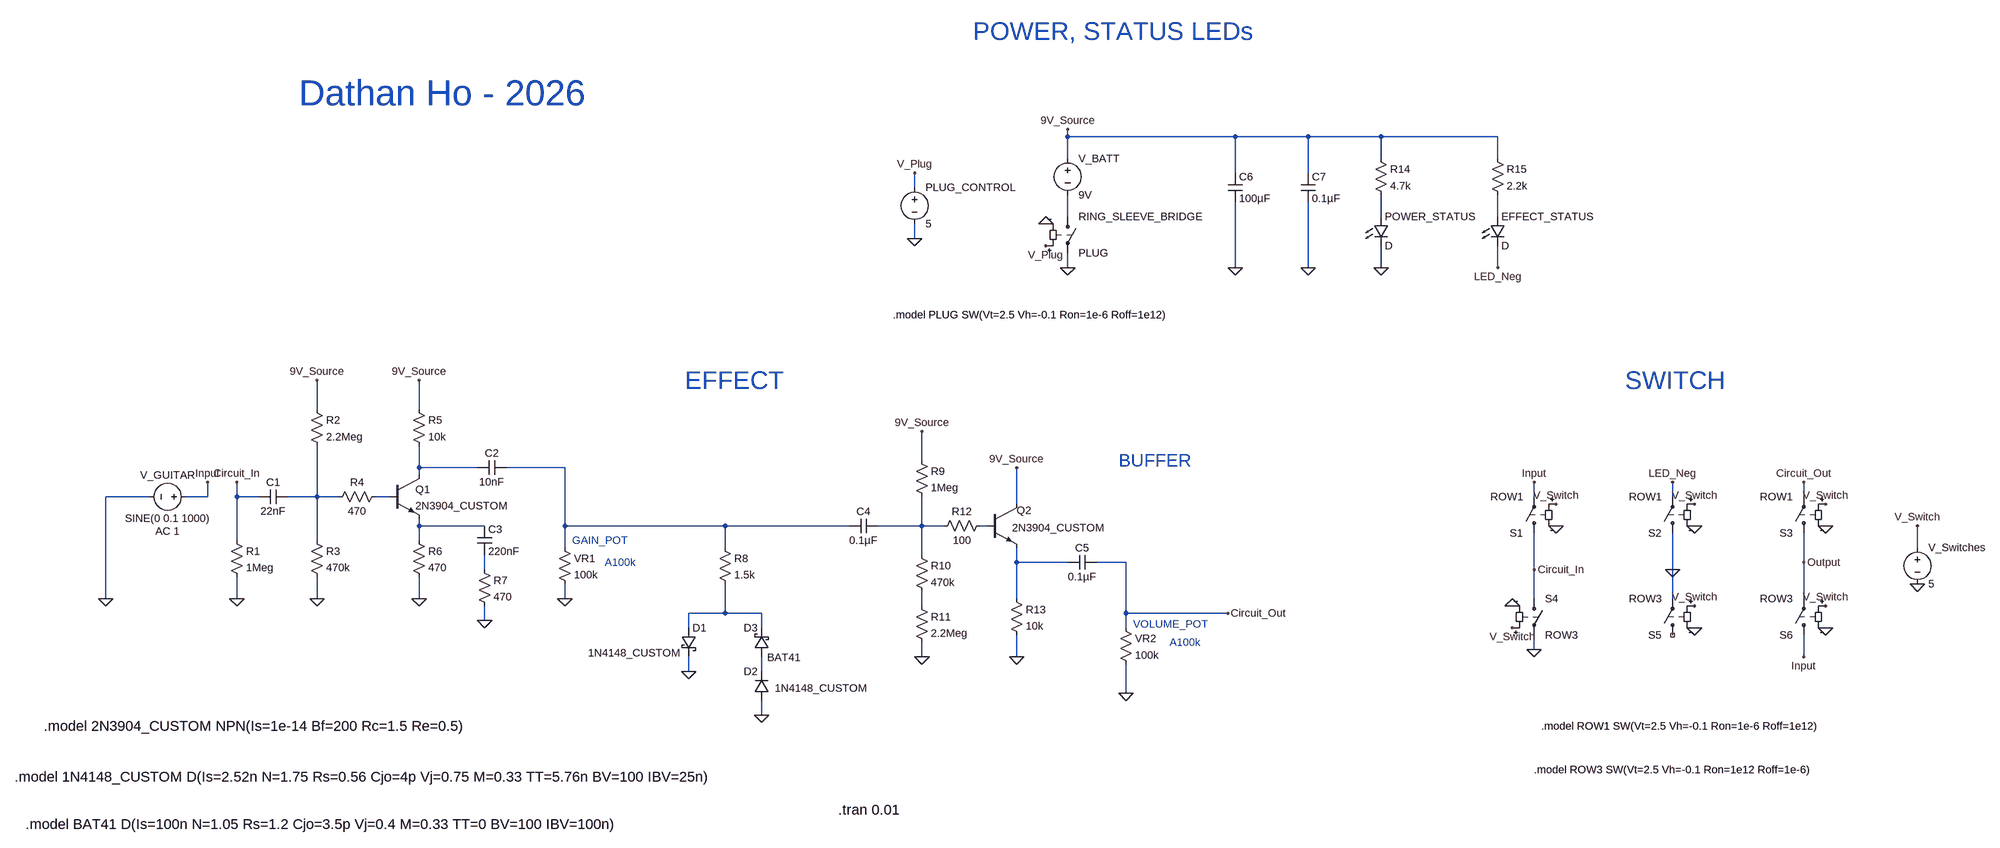
[diagram p0: schematic bjt-hard-clipping-overdrive-dh.asc]
bjt-hard-clipping-overdrive-dh.asc, the LTspice schematic file:
Version 4.1
SHEET 1 2288 1076
WIRE 224 -624 224 -640
WIRE 592 -624 224 -624
WIRE 752 -624 592 -624
WIRE 912 -624 752 -624
WIRE 1168 -624 912 -624
WIRE 224 -576 224 -624
WIRE 912 -576 912 -624
WIRE 1168 -576 1168 -624
WIRE 592 -544 592 -624
WIRE 752 -544 752 -624
WIRE -112 -512 -112 -544
WIRE 224 -448 224 -496
WIRE 912 -448 912 -496
WIRE 1168 -448 1168 -496
WIRE -112 -400 -112 -432
WIRE 224 -336 224 -368
WIRE 592 -336 592 -480
WIRE 752 -336 752 -480
WIRE 912 -336 912 -384
WIRE 1168 -336 1168 -384
WIRE -1424 144 -1424 80
WIRE -1200 144 -1200 80
WIRE -96 256 -96 192
WIRE -1200 272 -1200 224
WIRE -1072 272 -1200 272
WIRE -880 272 -1008 272
WIRE -1200 288 -1200 272
WIRE -1792 336 -1888 336
WIRE -1664 336 -1664 304
WIRE -1664 336 -1712 336
WIRE -1600 336 -1600 304
WIRE -1552 336 -1600 336
WIRE -1424 336 -1424 224
WIRE -1424 336 -1488 336
WIRE -1376 336 -1424 336
WIRE -1264 336 -1296 336
WIRE 1248 336 1248 304
WIRE 1552 336 1552 304
WIRE 1840 336 1840 304
WIRE 112 352 112 272
WIRE -1200 400 -1200 384
WIRE -1056 400 -1200 400
WIRE -880 400 -880 272
WIRE -528 400 -880 400
WIRE -256 400 -528 400
WIRE -96 400 -96 336
WIRE -96 400 -192 400
WIRE -48 400 -96 400
WIRE 48 400 32 400
WIRE -1600 432 -1600 336
WIRE -1424 432 -1424 336
WIRE -1200 432 -1200 400
WIRE -880 448 -880 400
WIRE -528 448 -528 400
WIRE 2128 448 2128 400
WIRE -96 464 -96 400
WIRE 112 480 112 448
WIRE 224 480 112 480
WIRE 352 480 288 480
WIRE 1840 480 1840 416
WIRE -1056 496 -1056 464
WIRE 1248 496 1248 416
WIRE 1552 496 1552 416
WIRE -1888 560 -1888 336
WIRE -1600 560 -1600 512
WIRE -1424 560 -1424 512
WIRE -1200 560 -1200 512
WIRE -880 560 -880 528
WIRE 112 560 112 480
WIRE 1248 560 1248 496
WIRE 1552 560 1552 496
WIRE 1840 560 1840 480
WIRE -96 576 -96 544
WIRE -528 592 -528 528
WIRE -528 592 -608 592
WIRE -448 592 -528 592
WIRE 352 592 352 480
WIRE 576 592 352 592
WIRE -1056 608 -1056 576
WIRE -608 624 -608 592
WIRE -448 624 -448 592
WIRE 352 624 352 592
WIRE 1248 672 1248 640
WIRE -96 688 -96 656
WIRE 112 688 112 640
WIRE 1840 688 1840 640
WIRE -608 720 -608 688
WIRE -448 720 -448 688
WIRE 352 768 352 704
WIRE -448 816 -448 784
FLAG 1296 400 0
FLAG 1600 400 0
FLAG 1888 400 0
FLAG 1888 624 0
FLAG 1600 624 0
FLAG 1200 576 0
FLAG 2128 528 0
FLAG 2128 400 V_Switch
FLAG 1888 352 V_Switch
FLAG 1600 352 V_Switch
FLAG 1296 352 V_Switch
FLAG 1200 624 V_Switch
FLAG 1600 576 V_Switch
FLAG 1888 576 V_Switch
FLAG 1248 304 Input
FLAG 1840 688 Input
FLAG 1248 496 Circuit_In
FLAG 1552 304 LED_Neg
FLAG 1552 496 0
FLAG 1840 480 Output
FLAG 1840 304 Circuit_Out
FLAG 1248 672 0
FLAG -1600 560 0
FLAG -1664 304 Input
FLAG -1888 560 0
FLAG -1200 560 0
FLAG -1424 560 0
FLAG 224 -640 9V_Source
FLAG -1424 80 9V_Source
FLAG -1200 80 9V_Source
FLAG -1600 304 Circuit_In
FLAG 1168 -336 LED_Neg
FLAG -880 560 0
FLAG -448 816 0
FLAG -608 720 0
FLAG -1056 608 0
FLAG 224 -336 0
FLAG 912 -336 0
FLAG -112 -400 0
FLAG -112 -544 V_Plug
FLAG 176 -432 0
FLAG 176 -384 V_Plug
FLAG 112 272 9V_Source
FLAG 112 688 0
FLAG 352 768 0
FLAG -96 688 0
FLAG -96 192 9V_Source
FLAG 576 592 Circuit_Out
FLAG 592 -336 0
FLAG 752 -336 0
SYMBOL sw 1248 432 R180
SYMATTR InstName S1
SYMATTR Value ROW1
SYMBOL sw 1552 432 R180
SYMATTR InstName S2
SYMATTR Value ROW1
SYMBOL sw 1840 432 R180
SYMATTR InstName S3
SYMATTR Value ROW1
SYMBOL sw 1248 544 R0
SYMATTR InstName S4
SYMATTR Value ROW3
SYMBOL sw 1552 656 R180
SYMATTR InstName S5
SYMATTR Value ROW3
SYMBOL sw 1840 656 R180
SYMATTR InstName S6
SYMATTR Value ROW3
SYMBOL voltage 2128 432 R0
WINDOW 123 0 0 Left 0
WINDOW 39 0 0 Left 0
SYMATTR InstName V_Switches
SYMATTR Value 5
SYMBOL voltage -1696 336 R90
WINDOW 0 -32 56 VBottom 2
WINDOW 3 32 56 VTop 2
WINDOW 123 60 56 VTop 2
WINDOW 39 0 0 Left 0
SYMATTR InstName V_GUITAR
SYMATTR Value SINE(0 0.1 1000)
SYMATTR Value2 AC 1
SYMBOL res -1616 416 R0
SYMATTR InstName R1
SYMATTR Value 1Meg
SYMBOL npn -1264 288 R0
SYMATTR InstName Q1
SYMATTR Value 2N3904_CUSTOM
SYMBOL voltage 224 -592 R0
SYMATTR InstName V_BATT
SYMATTR Value 9V
SYMBOL res -1216 128 R0
SYMATTR InstName R5
SYMATTR Value 10k
SYMBOL res -1216 416 R0
SYMATTR InstName R6
SYMATTR Value 470
SYMBOL cap -1488 320 R90
WINDOW 0 0 32 VBottom 2
WINDOW 3 32 32 VTop 2
SYMATTR InstName C1
SYMATTR Value 22nF
SYMBOL res -1440 128 R0
SYMATTR InstName R2
SYMATTR Value 2.2Meg
SYMBOL cap -1008 256 R90
WINDOW 0 0 32 VBottom 2
WINDOW 3 32 32 VTop 2
SYMATTR InstName C2
SYMATTR Value 10nF
SYMBOL LED 1152 -448 R0
SYMATTR InstName EFFECT_STATUS
SYMBOL res 1152 -592 R0
SYMATTR InstName R15
SYMATTR Value 2.2k
SYMBOL res -896 432 R0
SYMATTR InstName VR1
SYMATTR Value 100k
SYMBOL res -1280 320 R90
WINDOW 0 0 56 VBottom 2
WINDOW 3 32 56 VTop 2
SYMATTR InstName R4
SYMATTR Value 470
SYMBOL schottky -624 624 R0
WINDOW 3 -2 55 Right 2
SYMATTR Value 1N4148_CUSTOM
SYMATTR InstName D1
SYMATTR Description Diode
SYMATTR Type diode
SYMBOL schottky -432 688 R180
WINDOW 0 24 64 Left 2
WINDOW 3 -70 -1 Left 2
SYMATTR InstName D3
SYMATTR Value BAT41
SYMATTR Description Diode
SYMATTR Type diode
SYMBOL res -544 432 R0
SYMATTR InstName R8
SYMATTR Value 1.5k
SYMBOL res -1440 416 R0
SYMATTR InstName R3
SYMATTR Value 470k
SYMBOL cap -1072 400 R0
SYMATTR InstName C3
SYMATTR Value 220nF
SYMBOL res -1072 480 R0
SYMATTR InstName R7
SYMATTR Value 470
SYMBOL sw 224 -464 R0
SYMATTR InstName RING_SLEEVE_BRIDGE
SYMATTR Value PLUG
SYMBOL voltage -112 -528 R0
SYMATTR InstName PLUG_CONTROL
SYMATTR Value 5
SYMBOL LED 896 -448 R0
SYMATTR InstName POWER_STATUS
SYMBOL res 896 -592 R0
SYMATTR InstName R14
SYMATTR Value 4.7k
SYMBOL diode -432 784 R180
WINDOW 0 24 64 Left 2
WINDOW 3 -216 27 Left 2
SYMATTR InstName D2
SYMATTR Value 1N4148_CUSTOM
SYMBOL cap -192 384 R90
WINDOW 0 0 32 VBottom 2
WINDOW 3 32 32 VTop 2
SYMATTR InstName C4
SYMATTR Value 0.1µF
SYMBOL npn 48 352 R0
WINDOW 0 64 14 Left 2
WINDOW 3 54 52 Left 2
SYMATTR InstName Q2
SYMATTR Value 2N3904_CUSTOM
SYMBOL res 96 544 R0
SYMATTR InstName R13
SYMATTR Value 10k
SYMBOL res 336 608 R0
SYMATTR InstName VR2
SYMATTR Value 100k
SYMBOL res -112 240 R0
SYMATTR InstName R9
SYMATTR Value 1Meg
SYMBOL res -112 448 R0
SYMATTR InstName R10
SYMATTR Value 470k
SYMBOL cap 288 464 R90
WINDOW 0 0 32 VBottom 2
WINDOW 3 32 32 VTop 2
SYMATTR InstName C5
SYMATTR Value 0.1µF
SYMBOL res 48 384 R90
WINDOW 0 0 56 VBottom 2
WINDOW 3 32 56 VTop 2
SYMATTR InstName R12
SYMATTR Value 100
SYMBOL res -112 560 R0
SYMATTR InstName R11
SYMATTR Value 2.2Meg
SYMBOL cap 576 -544 R0
SYMATTR InstName C6
SYMATTR Value 100µF
SYMBOL cap 736 -544 R0
SYMATTR InstName C7
SYMATTR Value 0.1µF
TEXT 1264 840 Left 2 !.model ROW1 SW(Vt=2.5 Vh=-0.1 Ron=1e-6 Roff=1e12)
TEXT 1248 936 Left 2 !.model ROW3 SW(Vt=2.5 Vh=-0.1 Ron=1e12 Roff=1e-6)
TEXT -280 1024 Left 3 !.tran 0.01
TEXT -160 -232 Left 2 !.model PLUG SW(Vt=2.5 Vh=-0.1 Ron=1e-6 Roff=1e12)
TEXT 1448 80 Left 5 ;SWITCH
TEXT 16 -856 Left 5 ;POWER, STATUS LEDs
TEXT -616 80 Left 5 ;EFFECT
TEXT -2024 840 Left 3 !.model 2N3904_CUSTOM NPN(Is=1e-14 Bf=200 Rc=1.5 Re=0.5)
TEXT -2088 952 Left 3 !.model 1N4148_CUSTOM D(Is=2.52n N=1.75 Rs=0.56 Cjo=4p Vj=0.75 M=0.33 TT=5.76n BV=100 IBV=25n)
TEXT -2064 1056 Left 3 !.model BAT41 D(Is=100n N=1.05 Rs=1.2 Cjo=3.5p Vj=0.4 M=0.33 TT=0 BV=100 IBV=100n)
TEXT 336 256 Left 4 ;BUFFER
TEXT -864 432 Left 2 ;GAIN_POT
TEXT 368 616 Left 2 ;VOLUME_POT
TEXT -1464 -720 Left 6 ;Dathan Ho - 2026
TEXT -792 480 Left 2 ;A100k
TEXT 448 656 Left 2 ;A100k

The netlist it stands for:
* bjt-hard-clipping-overdrive-dh.asc
S1 Circuit_In Input V_Switch 0 ROW1
S2 0 LED_Neg V_Switch 0 ROW1
S3 Output Circuit_Out V_Switch 0 ROW1
S4 Circuit_In 0 V_Switch 0 ROW3
S5 NC_01 0 V_Switch 0 ROW3
S6 Input Output V_Switch 0 ROW3
V_Switches V_Switch 0 5
V_GUITAR Input 0 SINE(0 0.1 1000) AC 1
R1 Circuit_In 0 1Meg
Q1 N004 N007 N008 0 2N3904_CUSTOM
V_BATT 9V_Source N001 9V
R5 9V_Source N004 10k
R6 N008 0 470
C1 N006 Circuit_In 22nF
R2 9V_Source N006 2.2Meg
C2 N005 N004 10nF
D§EFFECT_STATUS N003 LED_Neg D
R15 9V_Source N003 2.2k
R§VR1 N005 0 100k
R4 N007 N006 470
D1 N014 0 1N4148_CUSTOM
D3 N015 N014 BAT41
R8 N005 N014 1.5k
R3 N006 0 470k
C3 N008 N012 220nF
R7 N012 0 470
S§RING_SLEEVE_BRIDGE N001 0 V_Plug 0 PLUG
V§PLUG_CONTROL V_Plug 0 5
D§POWER_STATUS N002 0 D
R14 9V_Source N002 4.7k
D2 0 N015 1N4148_CUSTOM
C4 N009 N005 0.1µF
Q2 9V_Source N010 N011 0 2N3904_CUSTOM
R13 N011 0 10k
R§VR2 Circuit_Out 0 100k
R9 9V_Source N009 1Meg
R10 N009 N013 470k
C5 Circuit_Out N011 0.1µF
R12 N010 N009 100
R11 N013 0 2.2Meg
C6 9V_Source 0 100µF
C7 9V_Source 0 0.1µF
.model D D
.lib standard.dio
.model NPN NPN
.model PNP PNP
.lib standard.bjt
.model ROW1 SW(Vt=2.5 Vh=-0.1 Ron=1e-6 Roff=1e12)
.model ROW3 SW(Vt=2.5 Vh=-0.1 Ron=1e12 Roff=1e-6)
.tran 0.01
.model PLUG SW(Vt=2.5 Vh=-0.1 Ron=1e-6 Roff=1e12)
* SWITCH
* POWER, STATUS LEDs
* EFFECT
.model 2N3904_CUSTOM NPN(Is=1e-14 Bf=200 Rc=1.5 Re=0.5)
.model 1N4148_CUSTOM D(Is=2.52n N=1.75 Rs=0.56 Cjo=4p Vj=0.75 M=0.33 TT=5.76n BV=100 IBV=25n)
.model BAT41 D(Is=100n N=1.05 Rs=1.2 Cjo=3.5p Vj=0.4 M=0.33 TT=0 BV=100 IBV=100n)
* BUFFER
* GAIN_POT
* VOLUME_POT
* Dathan Ho - 2026
* A100k
* A100k
.backanno
.end